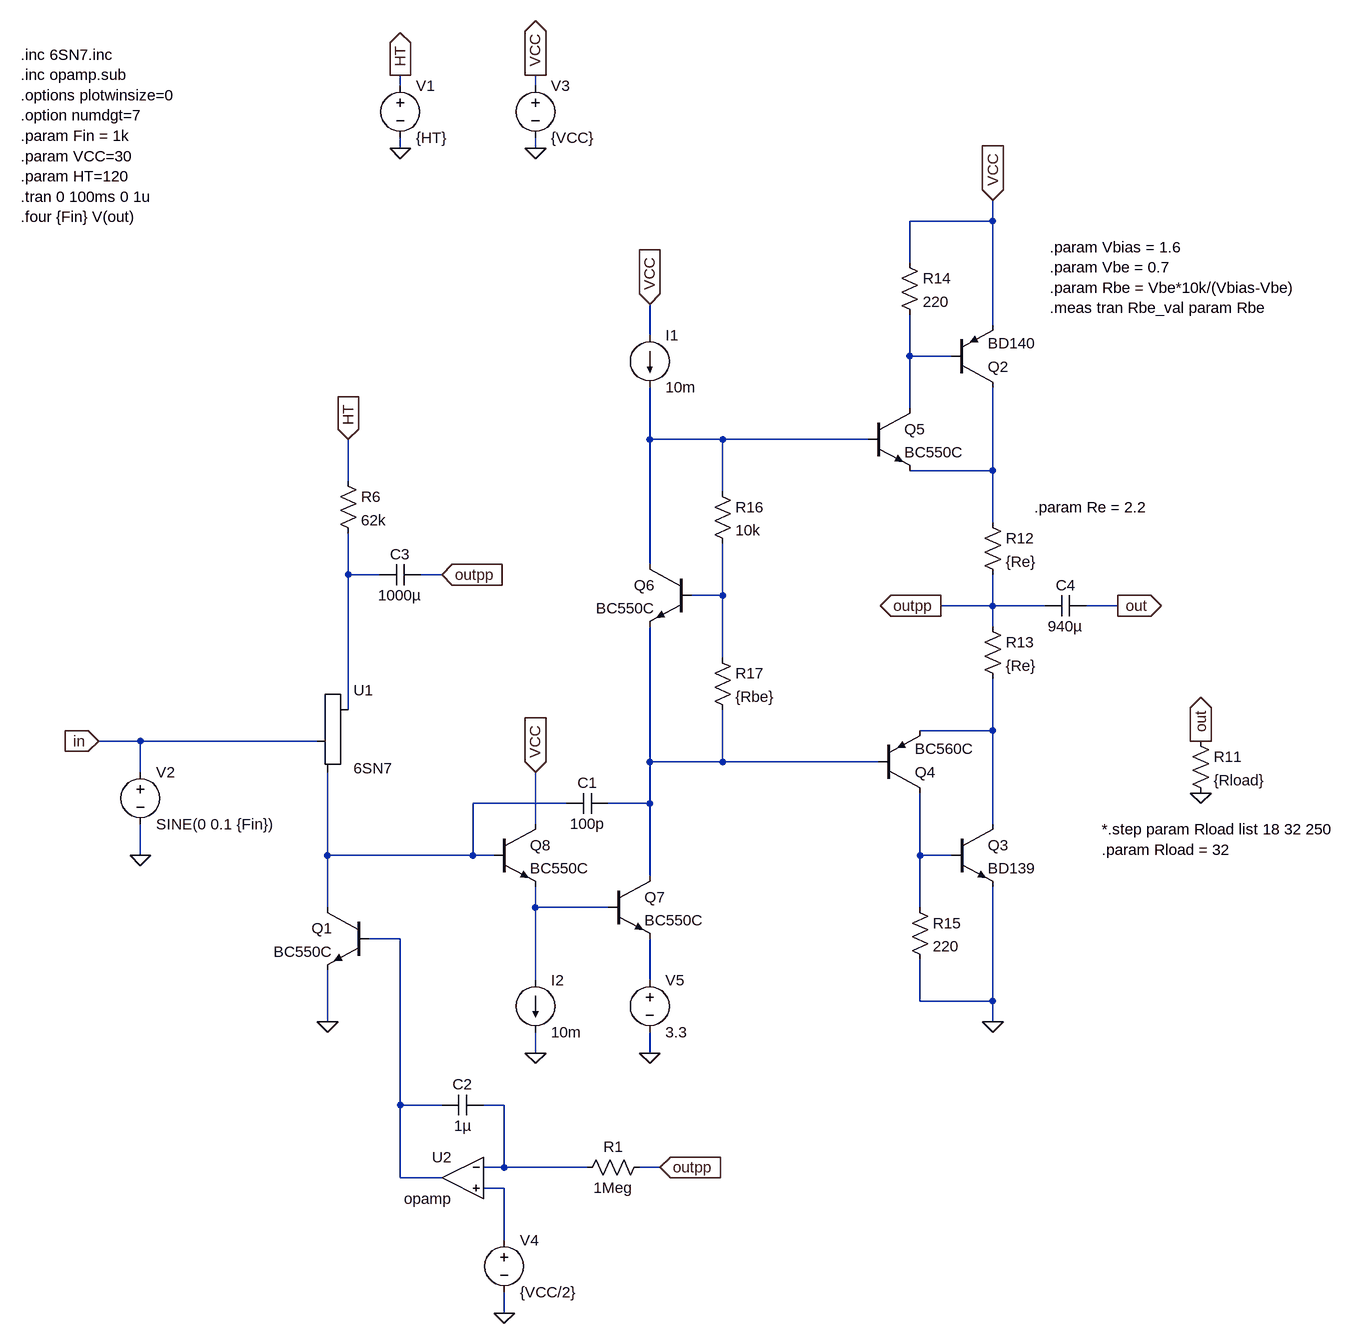
[diagram p0: schematic Super triode PP.asc]
Super triode PP.asc, the LTspice schematic file:
Version 4
SHEET 1 2520 1872
WIRE -192 -32 -192 -48
WIRE 16 -32 16 -48
WIRE -192 64 -192 48
WIRE 16 64 16 48
WIRE 720 176 720 144
WIRE 720 176 592 176
WIRE 592 240 592 176
WIRE 720 336 720 176
WIRE 192 352 192 304
WIRE 592 384 592 320
WIRE 656 384 592 384
WIRE 592 464 592 384
WIRE 192 512 192 432
WIRE 304 512 192 512
WIRE 528 512 304 512
WIRE 720 560 720 432
WIRE 720 560 592 560
WIRE -272 576 -272 512
WIRE 304 592 304 512
WIRE 720 640 720 560
WIRE 192 704 192 512
WIRE -272 720 -272 656
WIRE -224 720 -272 720
WIRE -128 720 -160 720
WIRE 304 752 304 672
WIRE 304 752 256 752
WIRE 720 768 720 720
WIRE 720 768 640 768
WIRE 800 768 720 768
WIRE 912 768 864 768
WIRE 720 800 720 768
WIRE 304 848 304 752
WIRE -272 928 -272 720
WIRE 720 960 720 880
WIRE 720 960 608 960
WIRE -592 976 -656 976
WIRE -320 976 -592 976
WIRE 192 1008 192 800
WIRE 304 1008 304 928
WIRE 304 1008 192 1008
WIRE 544 1008 304 1008
WIRE -592 1024 -592 976
WIRE 64 1072 -80 1072
WIRE 192 1072 192 1008
WIRE 192 1072 128 1072
WIRE 16 1104 16 1024
WIRE 720 1104 720 960
WIRE -592 1152 -592 1104
WIRE -304 1152 -304 1024
WIRE -80 1152 -80 1072
WIRE -80 1152 -304 1152
WIRE -48 1152 -80 1152
WIRE 608 1152 608 1056
WIRE 656 1152 608 1152
WIRE 192 1184 192 1072
WIRE -304 1232 -304 1152
WIRE 16 1232 16 1200
WIRE 128 1232 16 1232
WIRE 608 1232 608 1152
WIRE -192 1280 -240 1280
WIRE 16 1344 16 1232
WIRE 192 1344 192 1280
WIRE 608 1376 608 1312
WIRE 720 1376 720 1200
WIRE 720 1376 608 1376
WIRE -304 1408 -304 1328
WIRE 720 1408 720 1376
WIRE 16 1456 16 1424
WIRE 192 1456 192 1424
WIRE -192 1536 -192 1280
WIRE -128 1536 -192 1536
WIRE -32 1536 -64 1536
WIRE -32 1632 -32 1536
WIRE -32 1632 -64 1632
WIRE 96 1632 -32 1632
WIRE 208 1632 176 1632
WIRE -192 1648 -192 1536
WIRE -128 1648 -192 1648
WIRE -32 1664 -64 1664
WIRE -32 1744 -32 1664
WIRE -32 1856 -32 1824
FLAG -192 64 0
FLAG -592 1152 0
FLAG -192 -48 HT
IOPIN -192 -48 Out
FLAG -304 1408 0
FLAG -656 976 in
IOPIN -656 976 In
FLAG -272 512 HT
IOPIN -272 512 In
FLAG 16 64 0
FLAG 16 -48 VCC
IOPIN 16 -48 Out
FLAG 720 144 VCC
IOPIN 720 144 In
FLAG 912 768 out
IOPIN 912 768 Out
FLAG 1040 976 out
IOPIN 1040 976 Out
FLAG 1040 1056 0
FLAG 720 1408 0
FLAG 640 768 outpp
IOPIN 640 768 Out
FLAG 192 1456 0
FLAG 192 304 VCC
IOPIN 192 304 In
FLAG -128 720 outpp
IOPIN -128 720 In
FLAG 208 1632 outpp
IOPIN 208 1632 In
FLAG -32 1856 0
FLAG 16 1456 0
FLAG 16 1024 VCC
IOPIN 16 1024 In
SYMBOL voltage -192 -48 R0
SYMATTR InstName V1
SYMATTR Value {HT}
SYMBOL voltage -592 1008 R0
SYMATTR InstName V2
SYMATTR Value SINE(0 0.1 {Fin})
SYMATTR Value2 AC 1
SYMBOL Misc/triode -272 976 R0
SYMATTR InstName U1
SYMATTR Value 6SN7
SYMBOL res -288 560 R0
SYMATTR InstName R6
SYMATTR Value 62k
SYMBOL voltage 16 -48 R0
SYMATTR InstName V3
SYMATTR Value {VCC}
SYMBOL cap -160 704 R90
WINDOW 0 0 32 VBottom 2
WINDOW 3 32 32 VTop 2
SYMATTR InstName C3
SYMATTR Value 1000µ
SYMBOL res 1024 960 R0
SYMATTR InstName R11
SYMATTR Value {Rload}
SYMBOL res 704 624 R0
SYMATTR InstName R12
SYMATTR Value {Re}
SYMBOL res 704 784 R0
SYMATTR InstName R13
SYMATTR Value {Re}
SYMBOL pnp 656 432 M180
SYMATTR InstName Q2
SYMATTR Value BD140
SYMBOL npn 656 1104 R0
SYMATTR InstName Q3
SYMATTR Value BD139
SYMBOL cap 864 752 R90
WINDOW 0 0 32 VBottom 2
WINDOW 3 32 32 VTop 2
SYMATTR InstName C4
SYMATTR Value 940µ
SYMBOL pnp 544 1056 M180
SYMATTR InstName Q4
SYMATTR Value BC560C
SYMBOL npn 528 464 R0
SYMATTR InstName Q5
SYMATTR Value BC550C
SYMBOL res 576 224 R0
SYMATTR InstName R14
SYMATTR Value 220
SYMBOL res 592 1216 R0
SYMATTR InstName R15
SYMATTR Value 220
SYMBOL npn 256 704 M0
SYMATTR InstName Q6
SYMATTR Value BC550C
SYMBOL res 288 576 R0
SYMATTR InstName R16
SYMATTR Value 10k
SYMBOL res 288 832 R0
SYMATTR InstName R17
SYMATTR Value {Rbe}
SYMBOL npn 128 1184 R0
SYMATTR InstName Q7
SYMATTR Value BC550C
SYMBOL current 192 352 R0
SYMATTR InstName I1
SYMATTR Value 10m
SYMBOL cap 128 1056 R90
WINDOW 0 0 32 VBottom 2
WINDOW 3 32 32 VTop 2
SYMATTR InstName C1
SYMATTR Value 100p
SYMBOL Opamps/opamp -96 1584 M0
SYMATTR InstName U2
SYMBOL npn -240 1232 M0
SYMATTR InstName Q1
SYMATTR Value BC550C
SYMBOL cap -64 1520 R90
WINDOW 0 0 32 VBottom 2
WINDOW 3 32 32 VTop 2
SYMATTR InstName C2
SYMATTR Value 1µ
SYMBOL res 192 1616 R90
WINDOW 0 0 56 VBottom 2
WINDOW 3 32 56 VTop 2
SYMATTR InstName R1
SYMATTR Value 1Meg
SYMBOL voltage -32 1728 R0
SYMATTR InstName V4
SYMATTR Value {VCC/2}
SYMBOL voltage 192 1328 R0
SYMATTR InstName V5
SYMATTR Value 3.3
SYMBOL npn -48 1104 R0
SYMATTR InstName Q8
SYMATTR Value BC550C
SYMBOL current 16 1344 R0
SYMATTR InstName I2
SYMATTR Value 10m
TEXT -776 -80 Left 2 !.inc 6SN7.inc\n.inc opamp.sub\n.options plotwinsize=0\n.option numdgt=7\n.param Fin = 1k\n.param VCC=30\n.param HT=120\n.tran 0 100ms 0 1u\n.four {Fin} V(out)
TEXT 888 1112 Left 2 !*.step param Rload list 18 32 250\n.param Rload = 32
TEXT 808 216 Left 2 !.param Vbias = 1.6\n.param Vbe = 0.7\n.param Rbe = Vbe*10k/(Vbias-Vbe)\n.meas tran Rbe_val param Rbe
TEXT 784 616 Left 2 !.param Re = 2.2

The netlist it stands for:
* Super triode PP.asc
V1 HT 0 {HT}
V2 in 0 SINE(0 0.1 {Fin}) AC 1
XU1 N004 in N008 6SN7
R6 HT N004 62k
V3 VCC 0 {VCC}
C3 outpp N004 1000µ
R11 out 0 {Rload}
R12 N003 outpp {Re}
R13 outpp N006 {Re}
Q2 N003 N001 VCC 0 BD140
Q3 N006 N009 0 0 BD139
C4 out outpp 940µ
Q4 N009 N007 N006 0 BC560C
Q5 N001 N002 N003 0 BC550C
R14 VCC N001 220
R15 N009 0 220
Q6 N002 N005 N007 0 BC550C
R16 N002 N005 10k
R17 N005 N007 {Rbe}
Q7 N007 N010 N012 0 BC550C
I1 VCC N002 10m
C1 N007 N008 100p
XU2 N013 N014 N011 opamp Aol=100K GBW=10Meg  ; pins invin noninvin out
Q1 N008 N011 0 0 BC550C
C2 N013 N011 1µ
R1 outpp N013 1Meg
V4 N014 0 {VCC/2}
V5 N012 0 3.3
Q8 VCC N008 N010 0 BC550C
I2 N010 0 10m
.model NPN NPN
.model PNP PNP
.lib standard.bjt
.inc 6SN7.inc
.inc opamp.sub
.options plotwinsize=0
.option numdgt=7
.param Fin = 1k
.param VCC=30
.param HT=120
.tran 0 100ms 0 1u
.four {Fin} V(out)
*.step param Rload list 18 32 250
.param Rload = 32
.param Vbias = 1.6
.param Vbe = 0.7
.param Rbe = Vbe*10k/(Vbias-Vbe)
.meas tran Rbe_val param Rbe
.param Re = 2.2
.backanno
.end